# EasyEDA schematic Wiring Diagram_2020-10-13_10-57-28.json
TITLE: Complete Device Wiring Schematic; REV: 1.0; Date: 2020-10-13; Sheet: 1/1; Drawn By: mporeilly; Company: University of Calgary
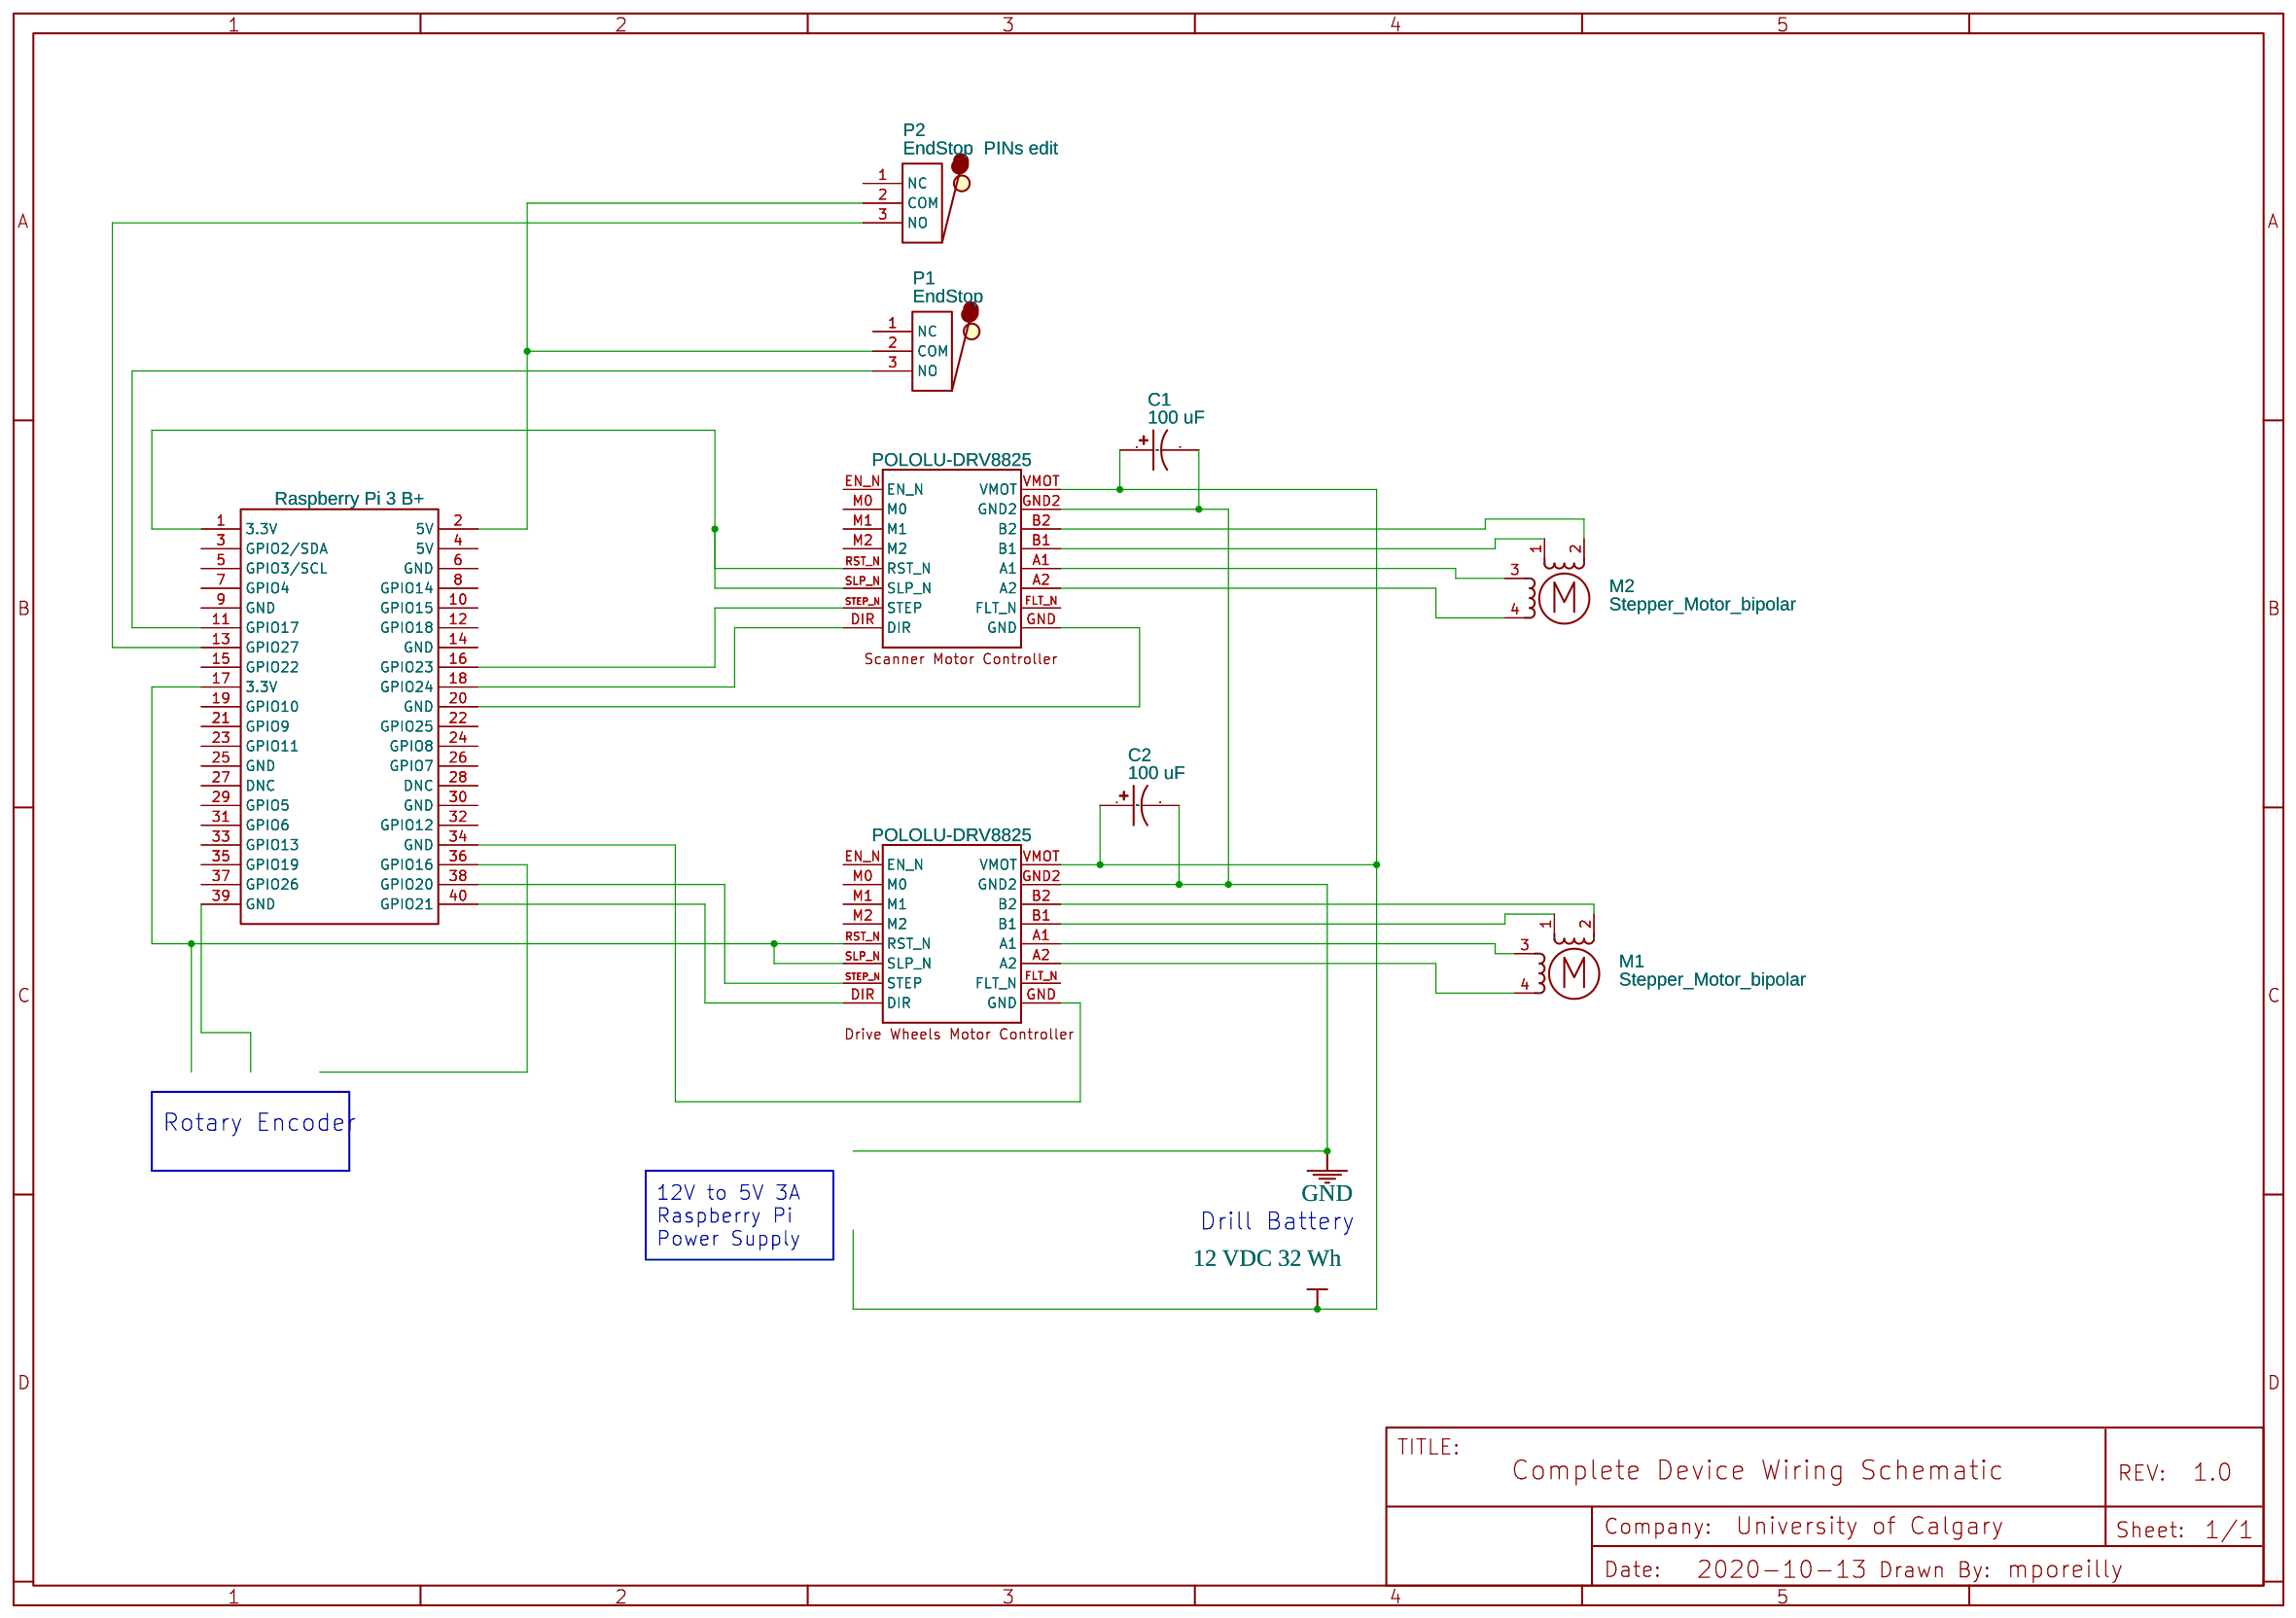
[diagram p0: schematic sheet]

## Parts
C1  100 uF  [CASE-A_3216]
C2  100 uF  [CASE-A_3216]
G$1  POLOLU-DRV8825  [POLOLU-DRV8825]
G$2  POLOLU-DRV8825  [POLOLU-DRV8825]
M1  Stepper_Motor_bipolar  [CONN-TH_4P-P2.50_XH-4A]
M2  Stepper_Motor_bipolar  [CONN-TH_4P-P2.50_XH-4A]
P1  EndStop  [ENDSTOP]
P2  EndStop  PINs edit  [ENDSTOP]
RPI1  Raspberry Pi 3 B+  [HDR-20X2/2.54]

## Library data of the parts
C1 C2 = C_Tan_SMD_A_US: Contributor: LCEDA_Lib
G$1 G$2 = POLOLU-DRV8825: Contributor: sagedot
M1 M2 = Stepper_Motor_bipolar: Contributor: KiCAD; license: https://www.gnu.org/licenses/lgpl-2.1.html
P1 = EndStop  PINs edit: Contributor: nosaliz; Supplier: None
P2 = EndStop  PINs edit: Manufacturer Part: EndStop; Contributor: nosaliz; Supplier: None
RPI1 = Raspberry Pi 3 B+: Contributor: Sases; Supplier: Adafruit; Manufacturer: Raspberry Pi; Supplier Part: 3775; Manufacturer Part: Raspberry Pi 3 - Model B+ - 1.4GHz Cortex-A53 with 1GB RAM

## Nets
GND: C1.2 C2.2 G$1.GND2 G$2.GND2
12 VDC 32 Wh: C1.1 C2.1 G$1.VMOT G$2.VMOT
Net-(G$1-A1): G$1.A1 M2.3
Net-(G$1-A2): G$1.A2 M2.4
Net-(G$1-B1): G$1.B1 M2.1
Net-(G$1-B2): G$1.B2 M2.2
Net-(G$1-DIR): G$1.DIR RPI1.18(GPIO24)
Net-(G$1-GND): G$1.GND RPI1.20(GND)
Net-(G$1-RST_N): G$1.RST_N G$1.SLP_N RPI1.1(3.3V)
Net-(G$1-STEP_N): G$1.STEP_N(STEP) RPI1.16(GPIO23)
Net-(G$2-A1): G$2.A1 M1.3
Net-(G$2-A2): G$2.A2 M1.4
Net-(G$2-B1): G$2.B1 M1.1
Net-(G$2-B2): G$2.B2 M1.2
Net-(G$2-DIR): G$2.DIR RPI1.40(GPIO21)
Net-(G$2-GND): G$2.GND RPI1.34(GND)
Net-(G$2-RST_N): G$2.RST_N G$2.SLP_N RPI1.17(3.3V)
Net-(G$2-STEP_N): G$2.STEP_N(STEP) RPI1.38(GPIO20)
Net-(P1-2): P1.2(COM) P2.2(COM) RPI1.2(5V)
Net-(P1-3): P1.3(NO) RPI1.11(GPIO17)
Net-(P2-3): P2.3(NO) RPI1.13(GPIO27)

Not connected (* = marked no-connect by the designer): G$1 EN_N FLT_N M0 M1 M2; G$2 EN_N FLT_N M0 M1 M2; P1 1(NC); P2 1(NC); RPI1 3(GPIO2/SDA) 4(5V) 5(GPIO3/SCL) 6(GND) 7(GPIO4) 8(GPIO14) 9(GND) 10(GPIO15) 12(GPIO18) 14(GND) 15(GPIO22) 19(GPIO10) 21(GPIO9) 22(GPIO25) 23(GPIO11) 24(GPIO8) 25(GND) 26(GPIO7) 27(DNC) 28(DNC) 29(GPIO5) 30(GND) 31(GPIO6) 32(GPIO12) 33(GPIO13) 35(GPIO19) 36(GPIO16) 37(GPIO26) 39(GND)

## Notes on the sheet
- Rotary Encoder
- 12V to 5V 3A
  Raspberry Pi
  Power Supply
- Drill Battery
